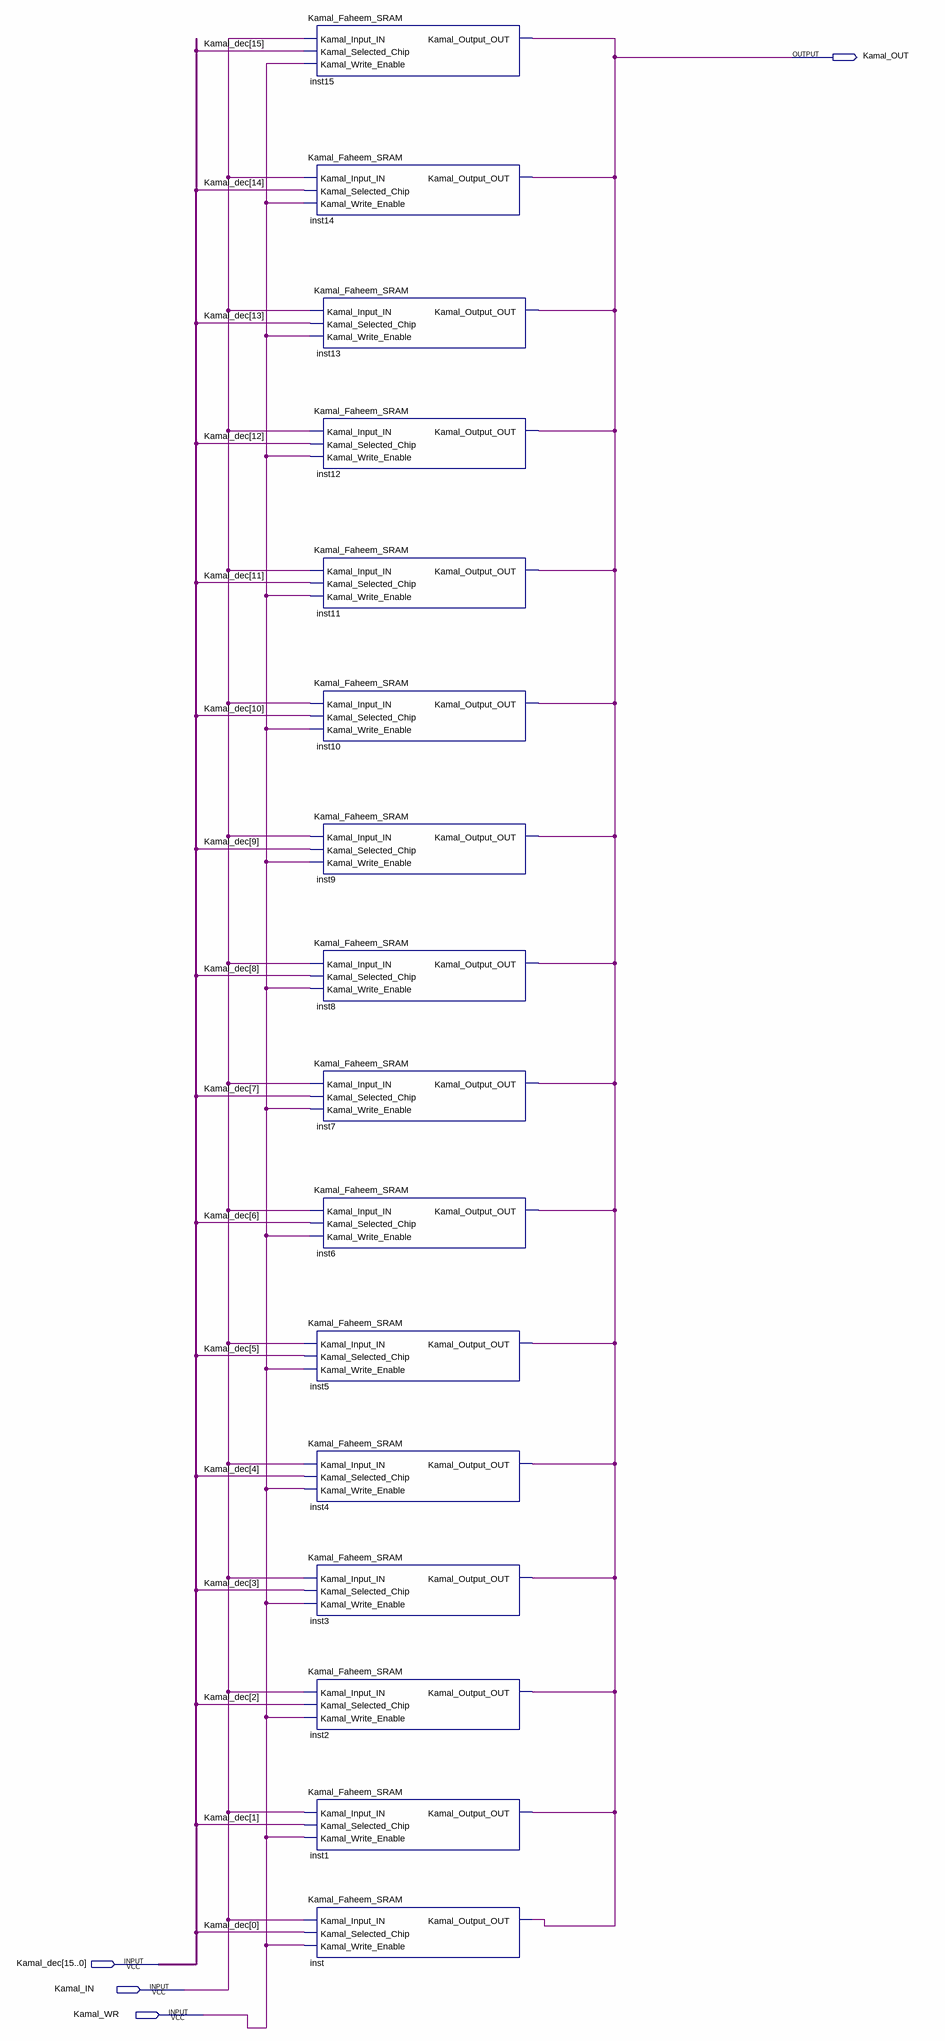
[diagram p0: schematic sheet]
// Quartus schematic Kamal_Faheem_16x1SRAM.bdf as structural Verilog: 16 symbols, 4 pins
module Kamal_Faheem_16x1SRAM (
  input  [15:0] Kamal_dec,
  input  Kamal_IN,
  input  Kamal_WR,
  output Kamal_OUT
);

  Kamal_Faheem_SRAM inst15 (
    .Kamal_Input_IN(Kamal_IN), .Kamal_Selected_Chip(Kamal_dec[15]), .Kamal_Write_Enable(Kamal_WR),
    .Kamal_Output_OUT(Kamal_OUT));
  Kamal_Faheem_SRAM inst14 (
    .Kamal_Input_IN(Kamal_IN), .Kamal_Selected_Chip(Kamal_dec[14]), .Kamal_Write_Enable(Kamal_WR),
    .Kamal_Output_OUT(Kamal_OUT));
  Kamal_Faheem_SRAM inst13 (
    .Kamal_Input_IN(Kamal_IN), .Kamal_Selected_Chip(Kamal_dec[13]), .Kamal_Write_Enable(Kamal_WR),
    .Kamal_Output_OUT(Kamal_OUT));
  Kamal_Faheem_SRAM inst12 (
    .Kamal_Input_IN(Kamal_IN), .Kamal_Selected_Chip(Kamal_dec[12]), .Kamal_Write_Enable(Kamal_WR),
    .Kamal_Output_OUT(Kamal_OUT));
  Kamal_Faheem_SRAM inst11 (
    .Kamal_Input_IN(Kamal_IN), .Kamal_Selected_Chip(Kamal_dec[11]), .Kamal_Write_Enable(Kamal_WR),
    .Kamal_Output_OUT(Kamal_OUT));
  Kamal_Faheem_SRAM inst10 (
    .Kamal_Input_IN(Kamal_IN), .Kamal_Selected_Chip(Kamal_dec[10]), .Kamal_Write_Enable(Kamal_WR),
    .Kamal_Output_OUT(Kamal_OUT));
  Kamal_Faheem_SRAM inst9 (
    .Kamal_Input_IN(Kamal_IN), .Kamal_Selected_Chip(Kamal_dec[9]), .Kamal_Write_Enable(Kamal_WR),
    .Kamal_Output_OUT(Kamal_OUT));
  Kamal_Faheem_SRAM inst8 (
    .Kamal_Input_IN(Kamal_IN), .Kamal_Selected_Chip(Kamal_dec[8]), .Kamal_Write_Enable(Kamal_WR),
    .Kamal_Output_OUT(Kamal_OUT));
  Kamal_Faheem_SRAM inst7 (
    .Kamal_Input_IN(Kamal_IN), .Kamal_Selected_Chip(Kamal_dec[7]), .Kamal_Write_Enable(Kamal_WR),
    .Kamal_Output_OUT(Kamal_OUT));
  Kamal_Faheem_SRAM inst6 (
    .Kamal_Input_IN(Kamal_IN), .Kamal_Selected_Chip(Kamal_dec[6]), .Kamal_Write_Enable(Kamal_WR),
    .Kamal_Output_OUT(Kamal_OUT));
  Kamal_Faheem_SRAM inst5 (
    .Kamal_Input_IN(Kamal_IN), .Kamal_Selected_Chip(Kamal_dec[5]), .Kamal_Write_Enable(Kamal_WR),
    .Kamal_Output_OUT(Kamal_OUT));
  Kamal_Faheem_SRAM inst4 (
    .Kamal_Input_IN(Kamal_IN), .Kamal_Selected_Chip(Kamal_dec[4]), .Kamal_Write_Enable(Kamal_WR),
    .Kamal_Output_OUT(Kamal_OUT));
  Kamal_Faheem_SRAM inst3 (
    .Kamal_Input_IN(Kamal_IN), .Kamal_Selected_Chip(Kamal_dec[3]), .Kamal_Write_Enable(Kamal_WR),
    .Kamal_Output_OUT(Kamal_OUT));
  Kamal_Faheem_SRAM inst2 (
    .Kamal_Input_IN(Kamal_IN), .Kamal_Selected_Chip(Kamal_dec[2]), .Kamal_Write_Enable(Kamal_WR),
    .Kamal_Output_OUT(Kamal_OUT));
  Kamal_Faheem_SRAM inst1 (
    .Kamal_Input_IN(Kamal_IN), .Kamal_Selected_Chip(Kamal_dec[1]), .Kamal_Write_Enable(Kamal_WR),
    .Kamal_Output_OUT(Kamal_OUT));
  Kamal_Faheem_SRAM inst (
    .Kamal_Input_IN(Kamal_IN), .Kamal_Selected_Chip(Kamal_dec[0]), .Kamal_Write_Enable(Kamal_WR),
    .Kamal_Output_OUT(Kamal_OUT));
endmodule
